# EAGLE schematic BEP32_Test_Interface7 (EAGLE 7.7.0)
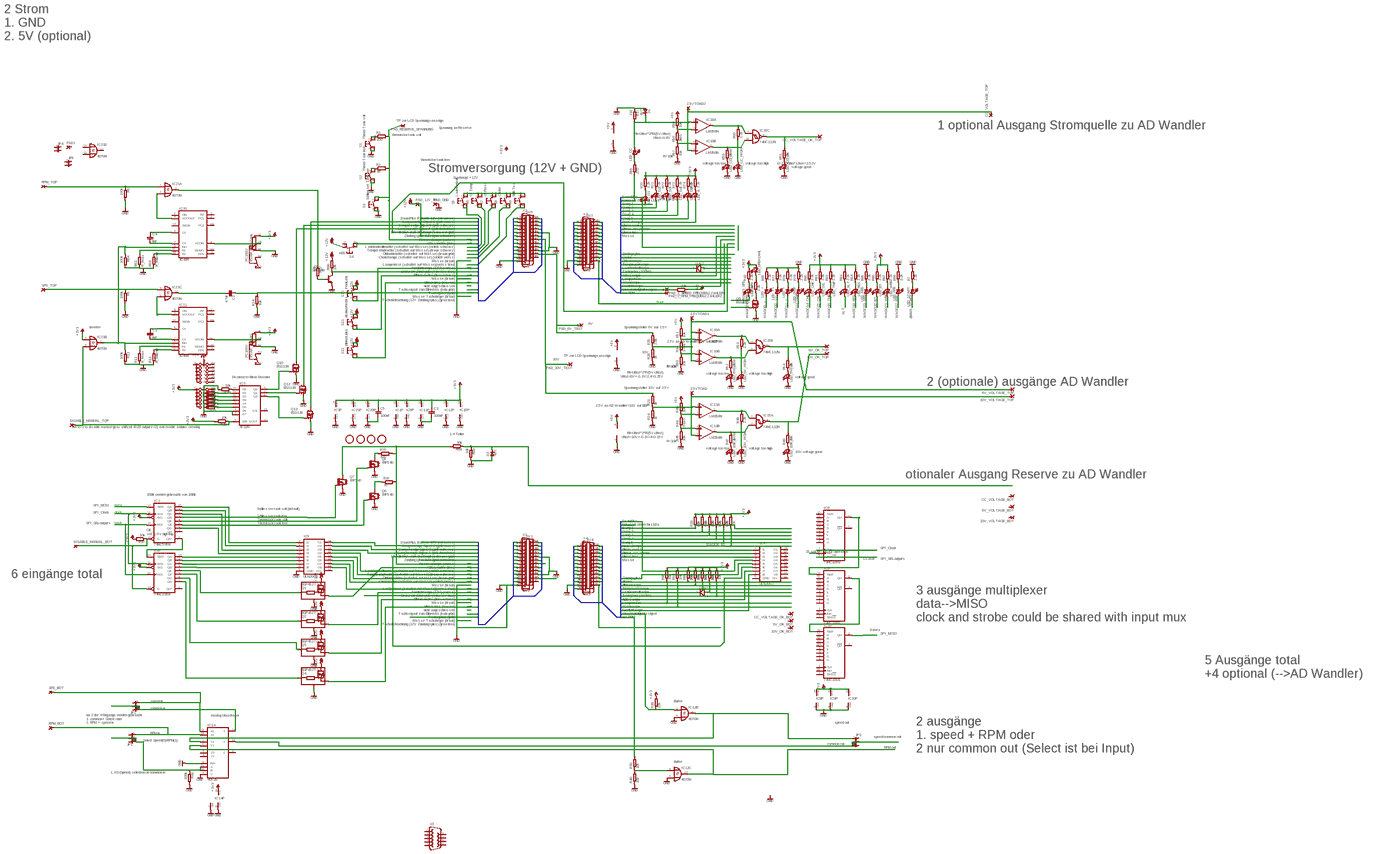
[diagram p0: schematic, sheet 1, overview]
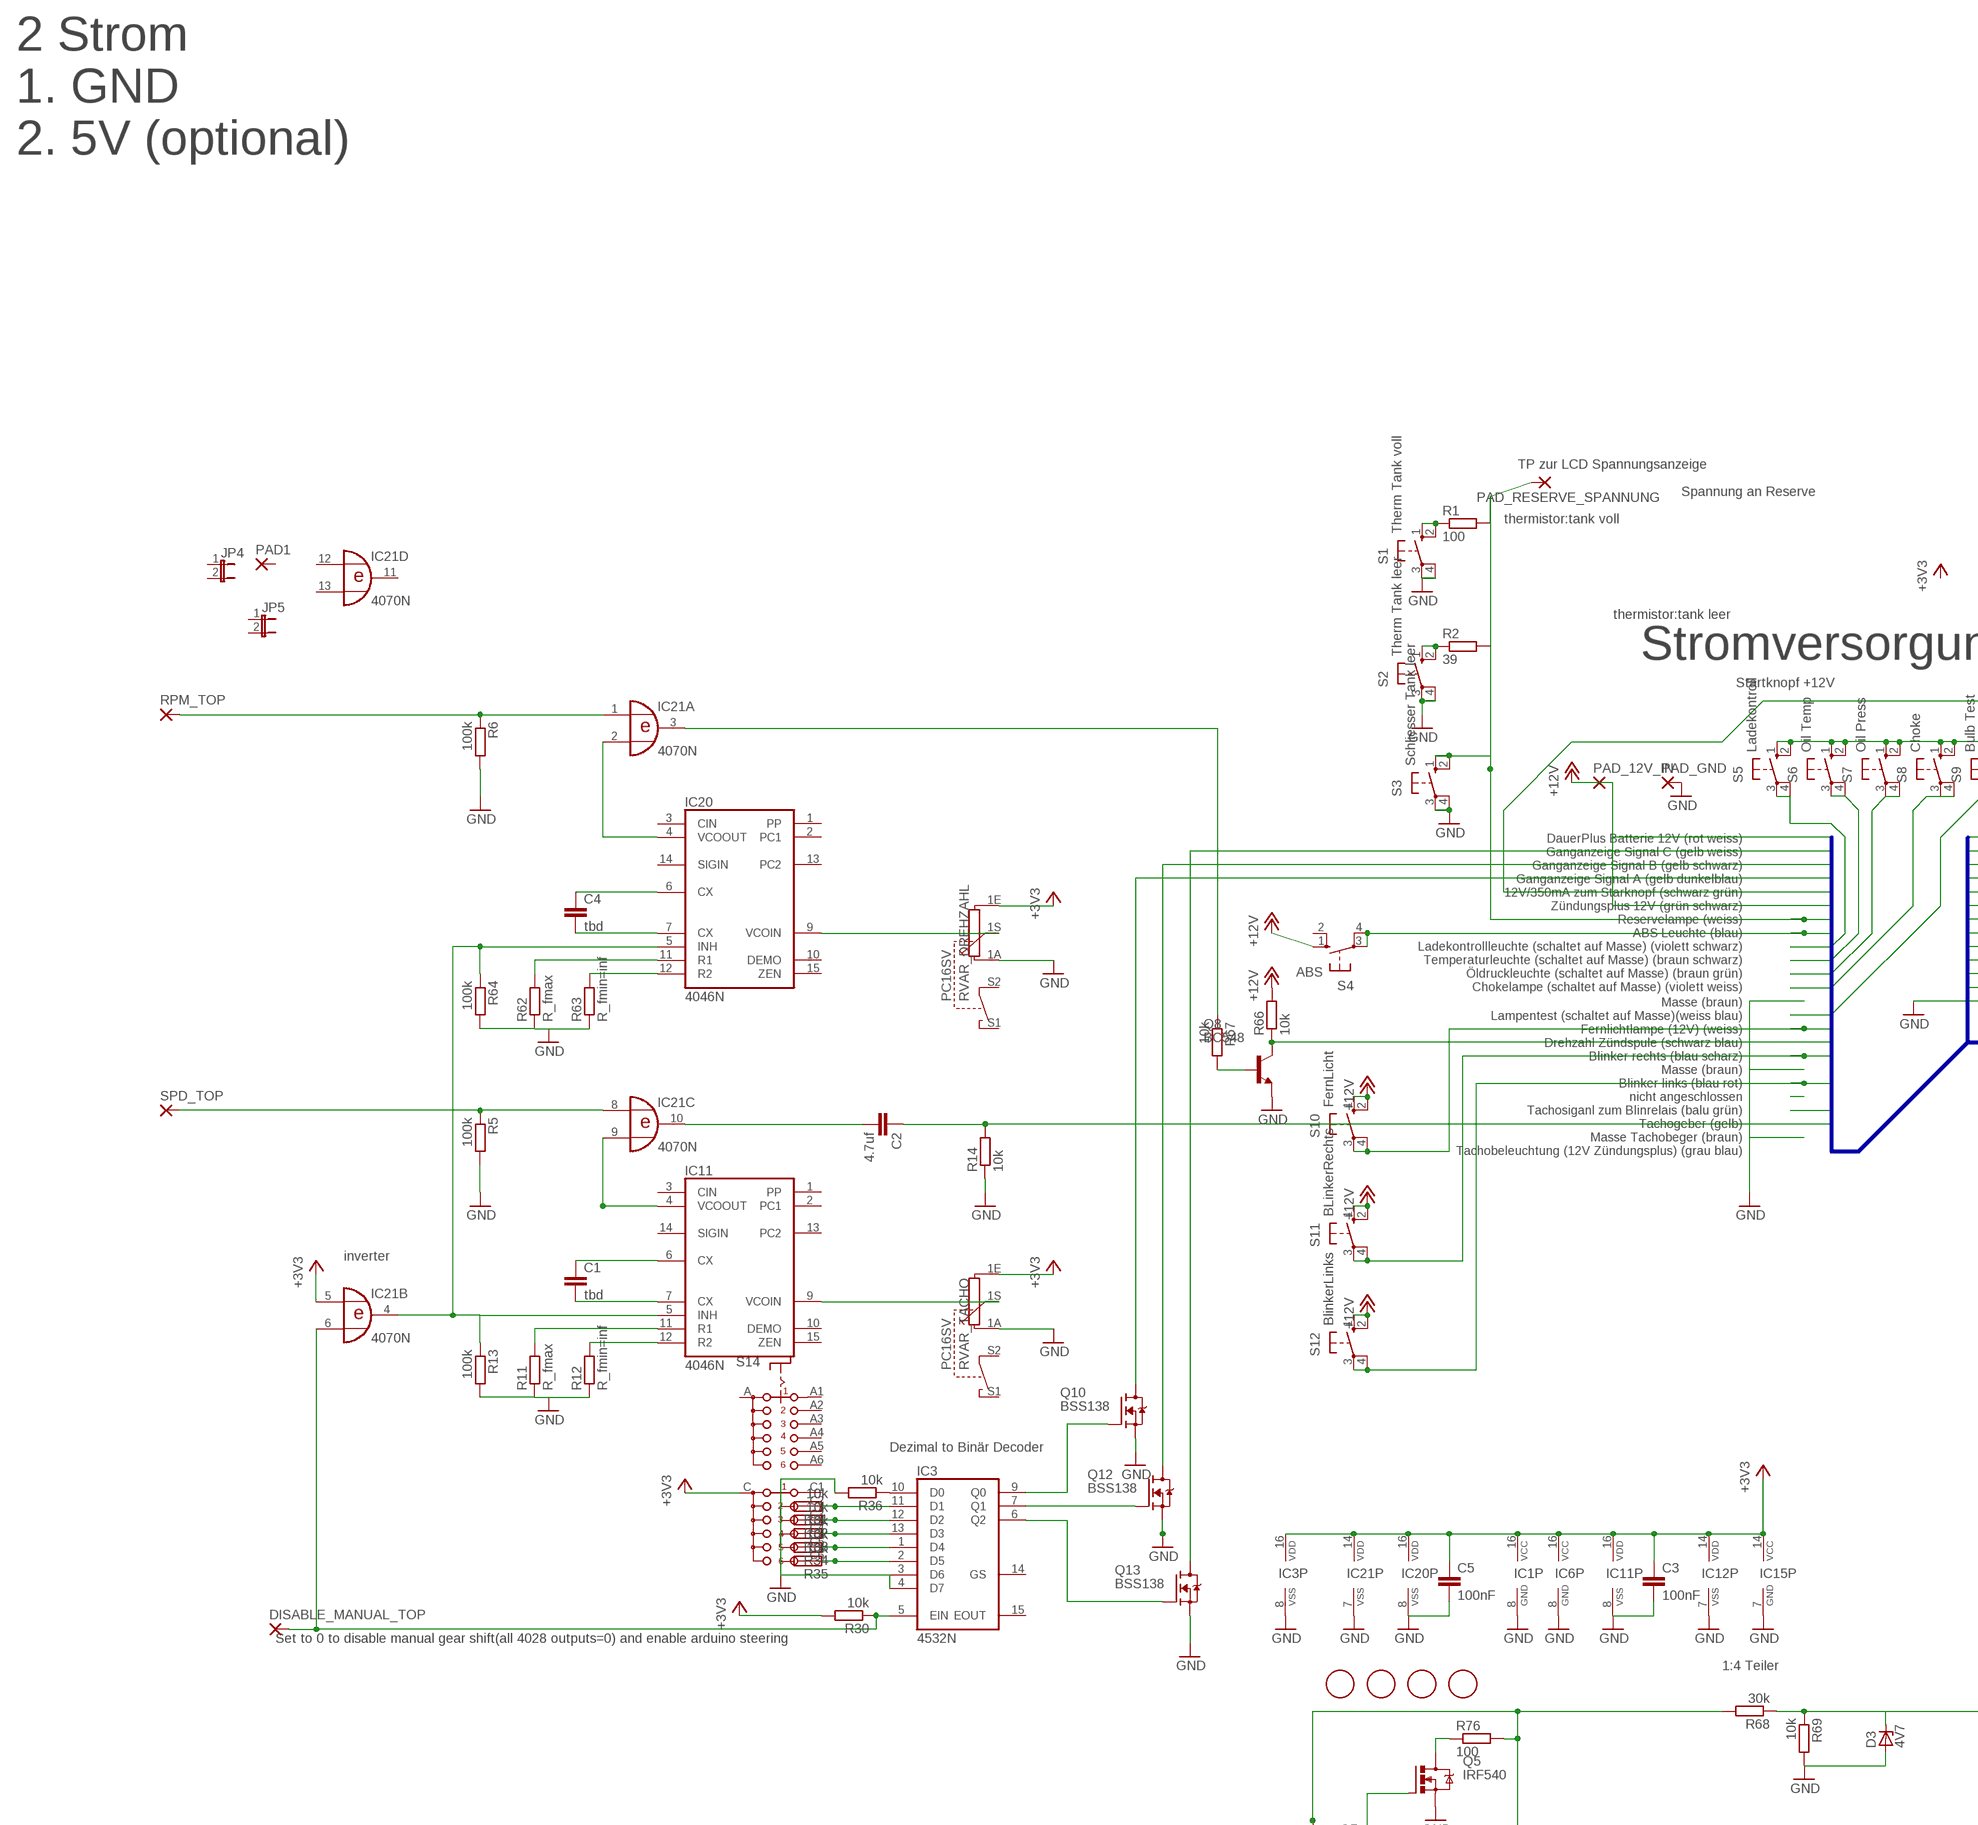
[diagram p1: schematic, sheet 1, part 1 of 6]
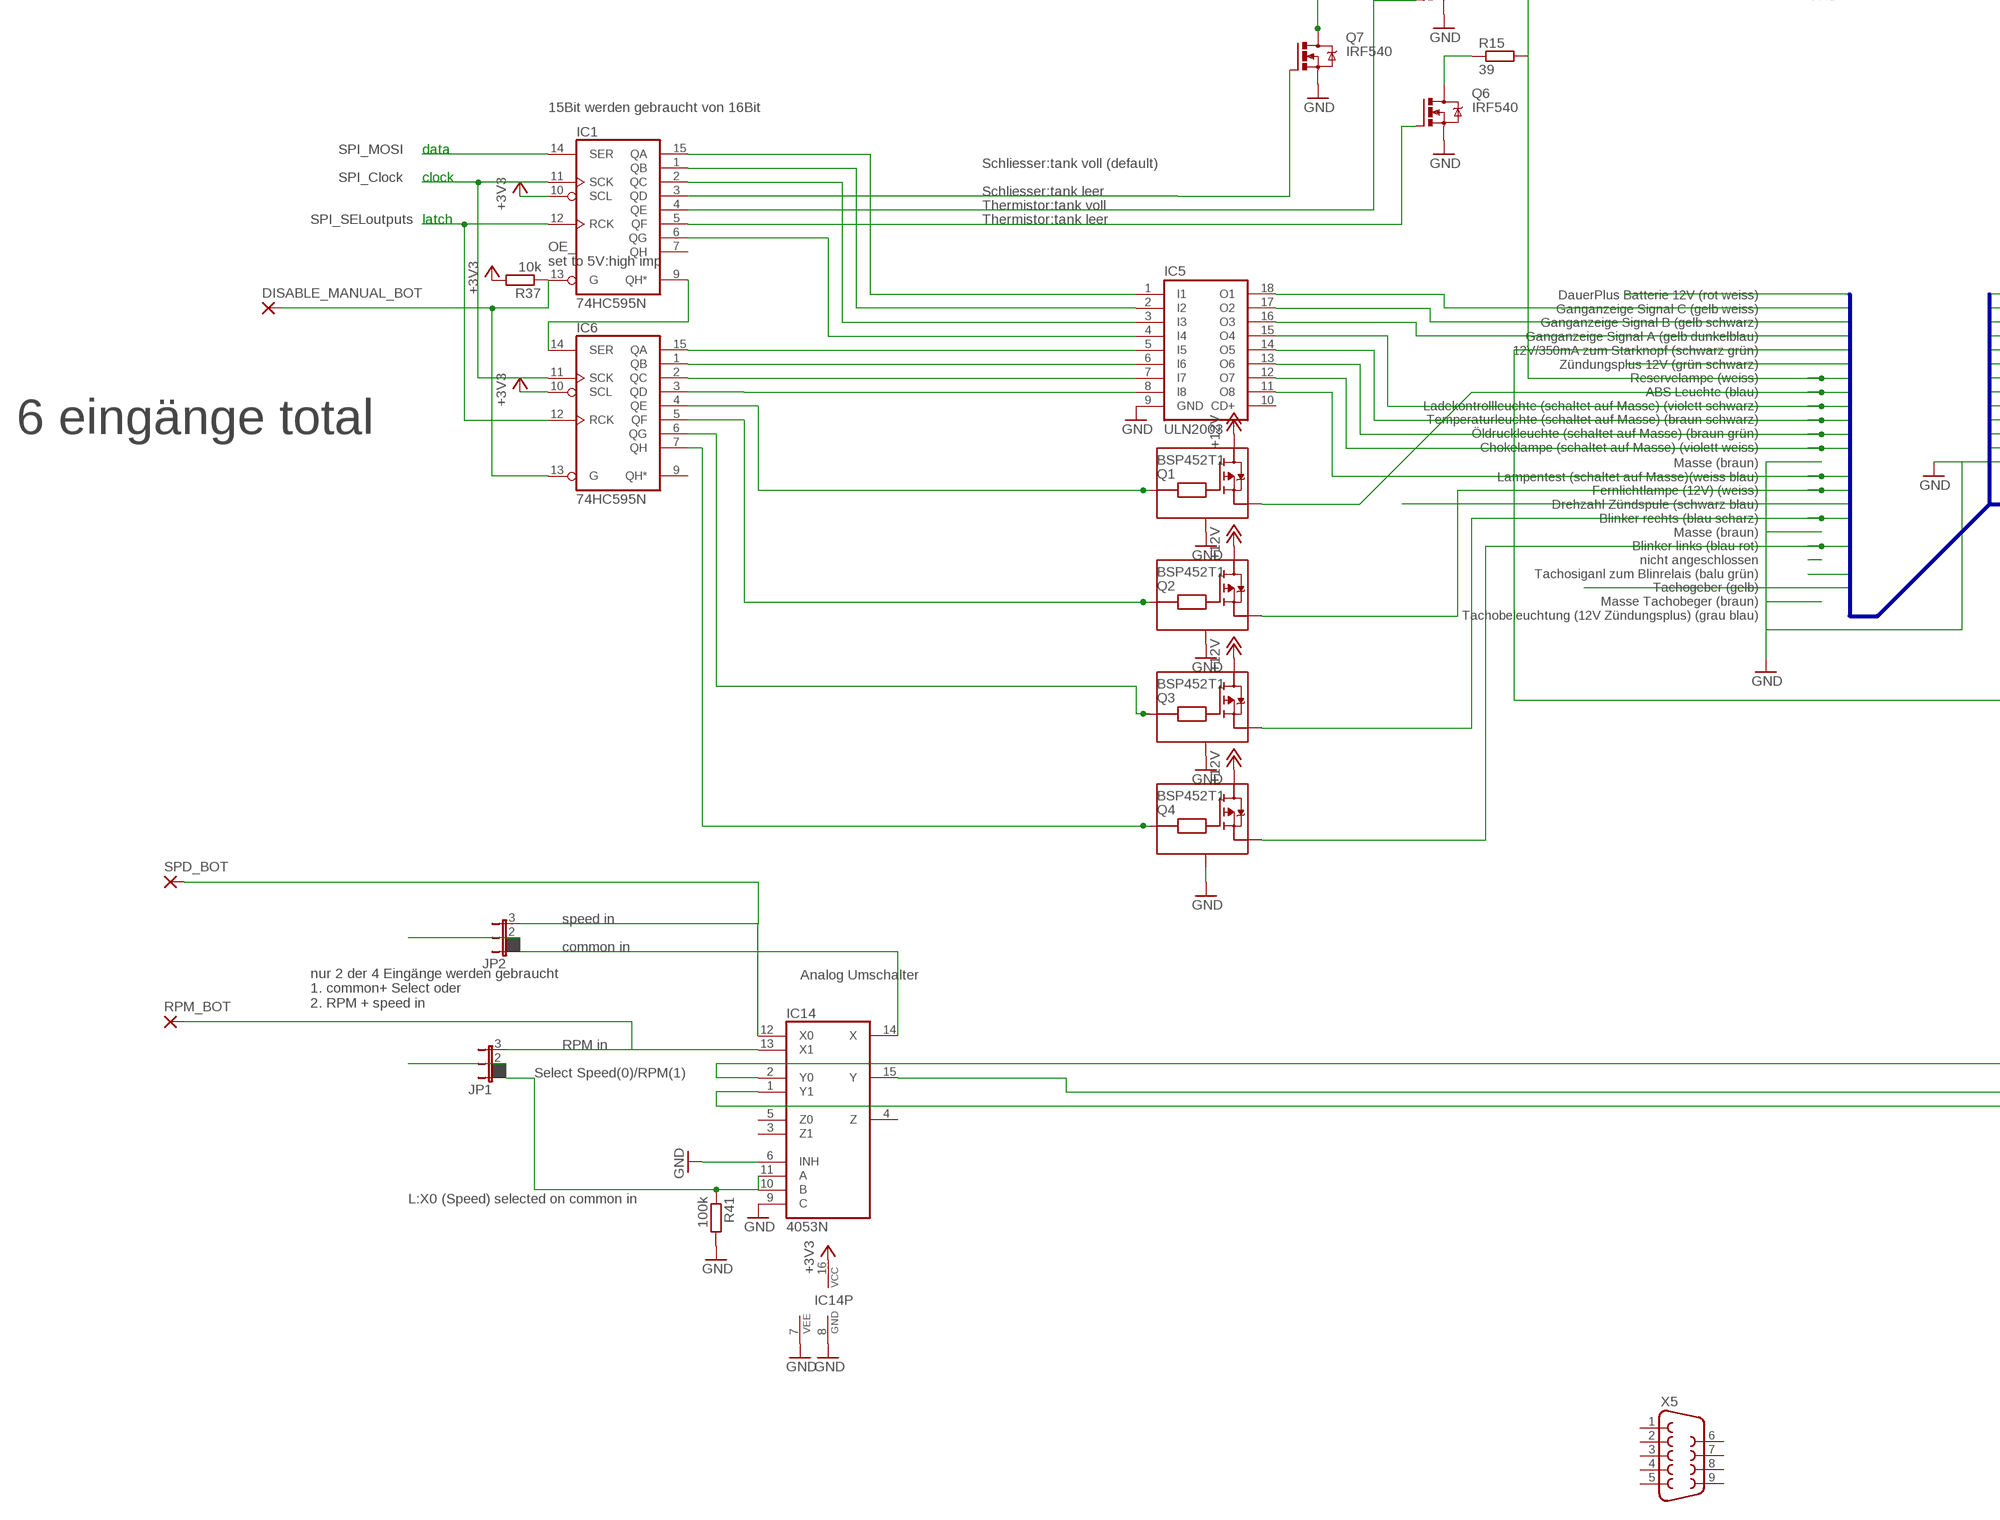
[diagram p2: schematic, sheet 1, part 2 of 6]
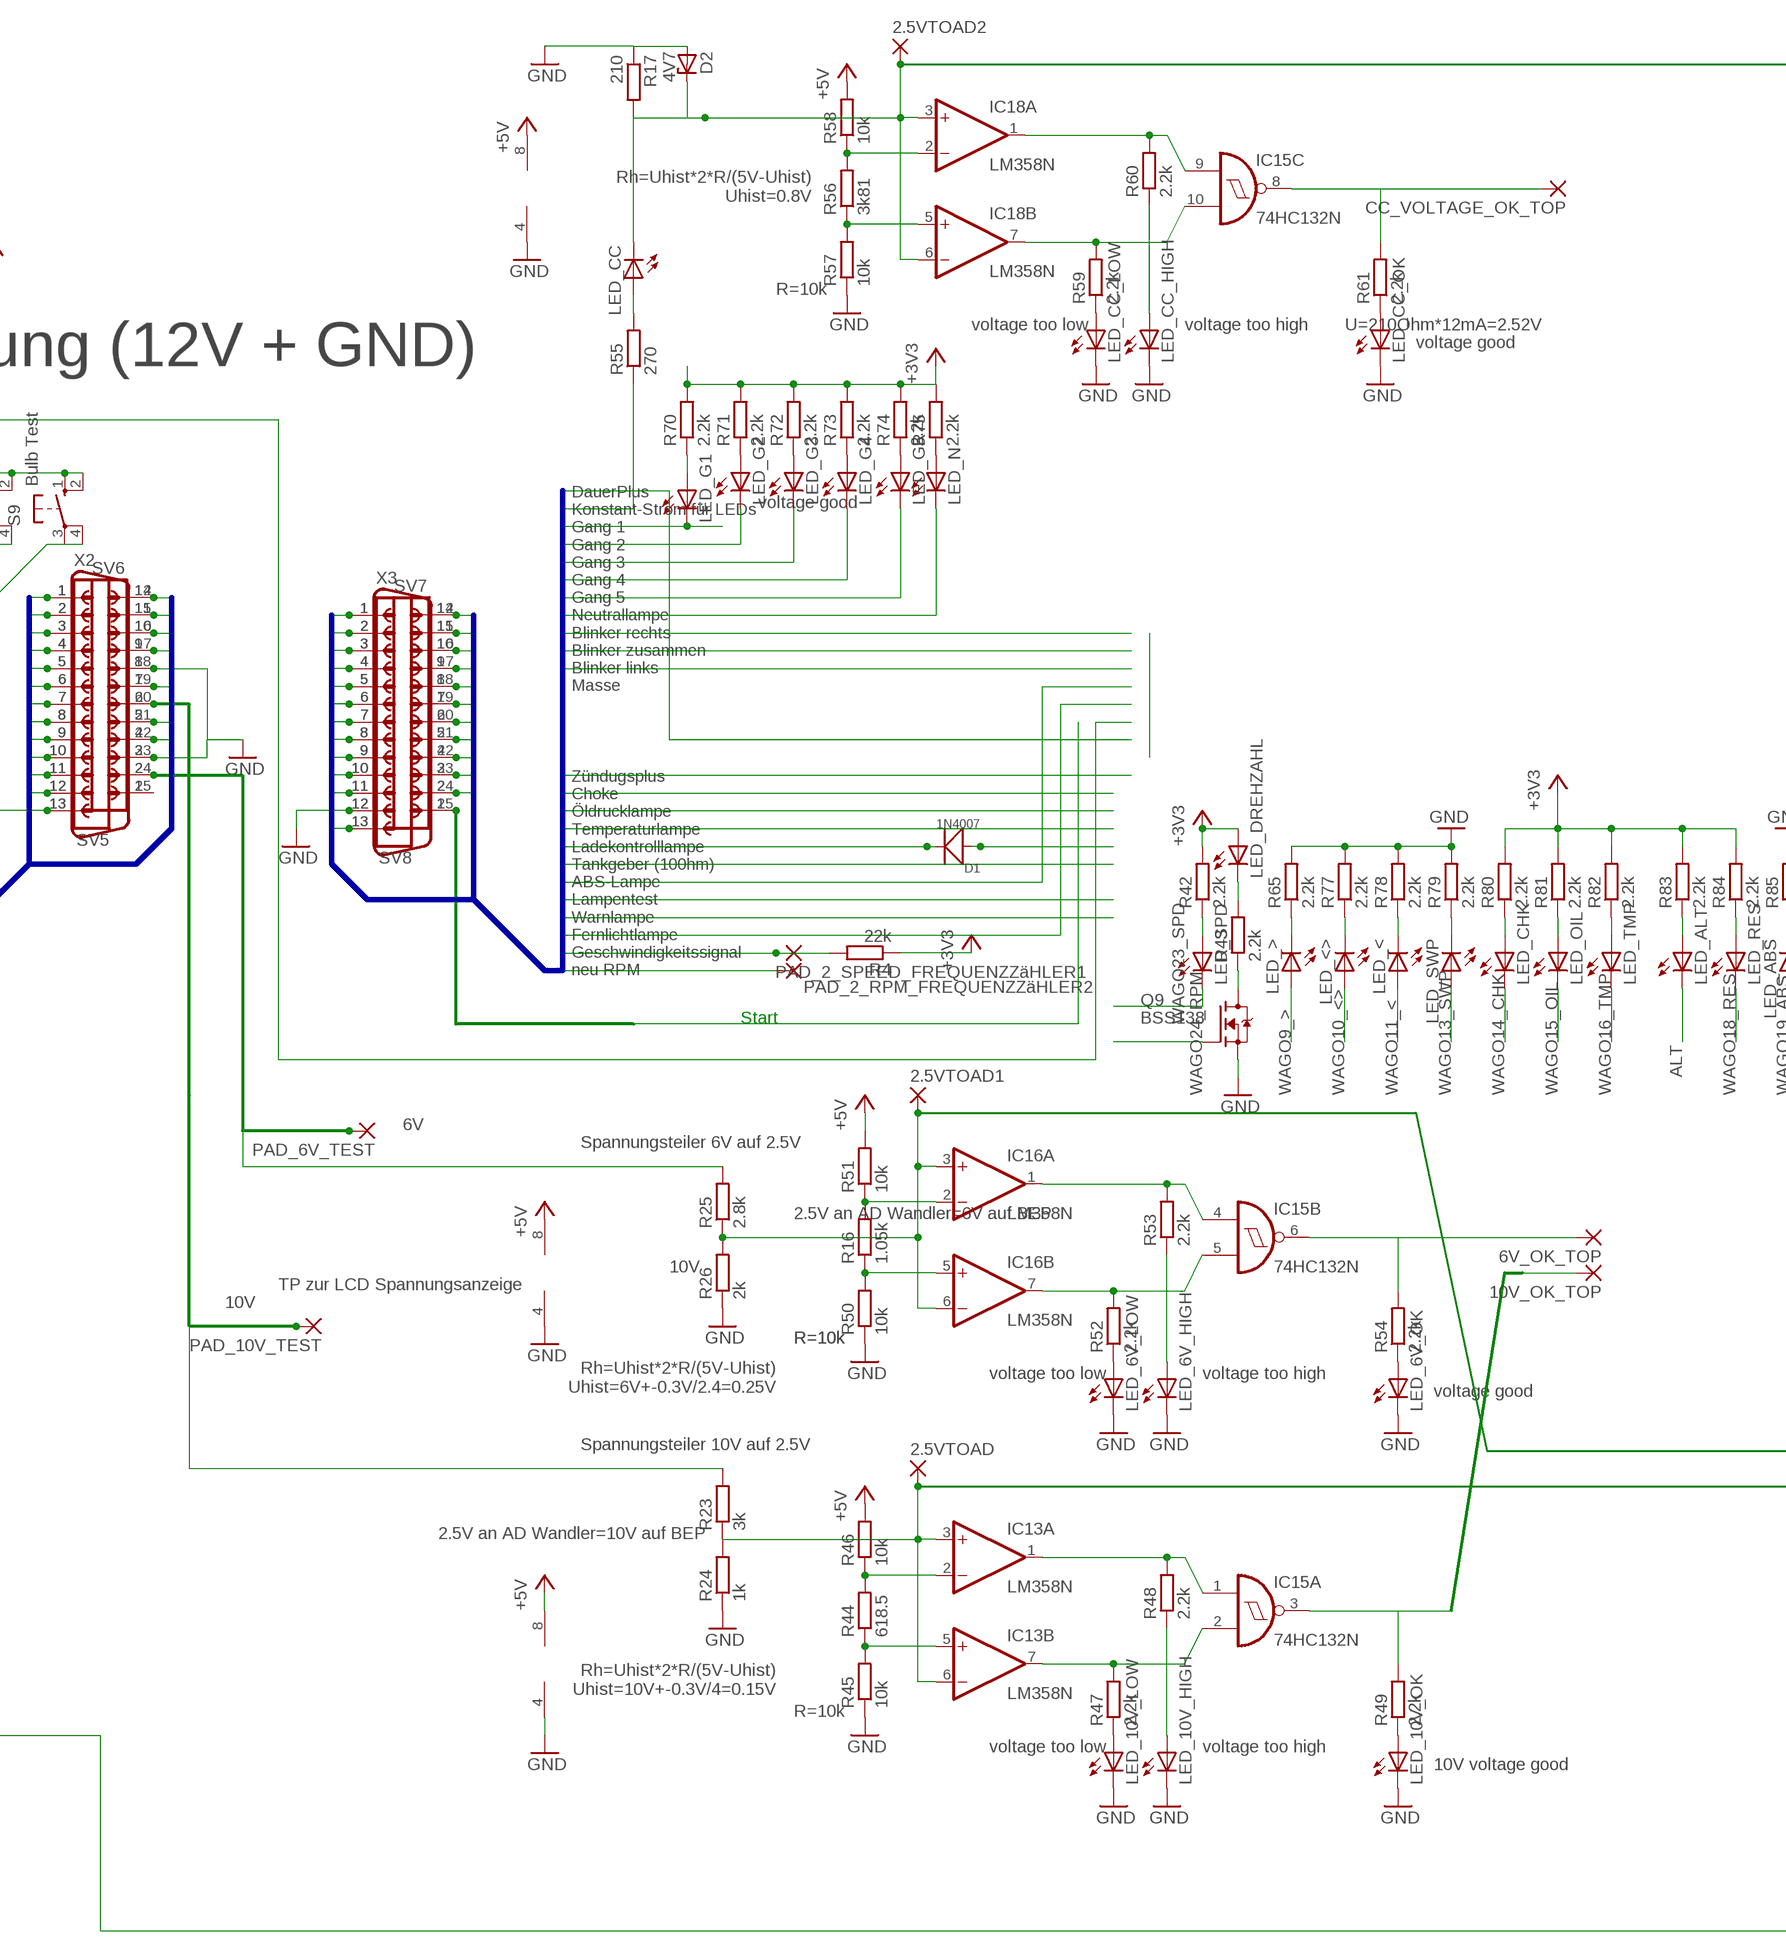
[diagram p3: schematic, sheet 1, part 3 of 6]
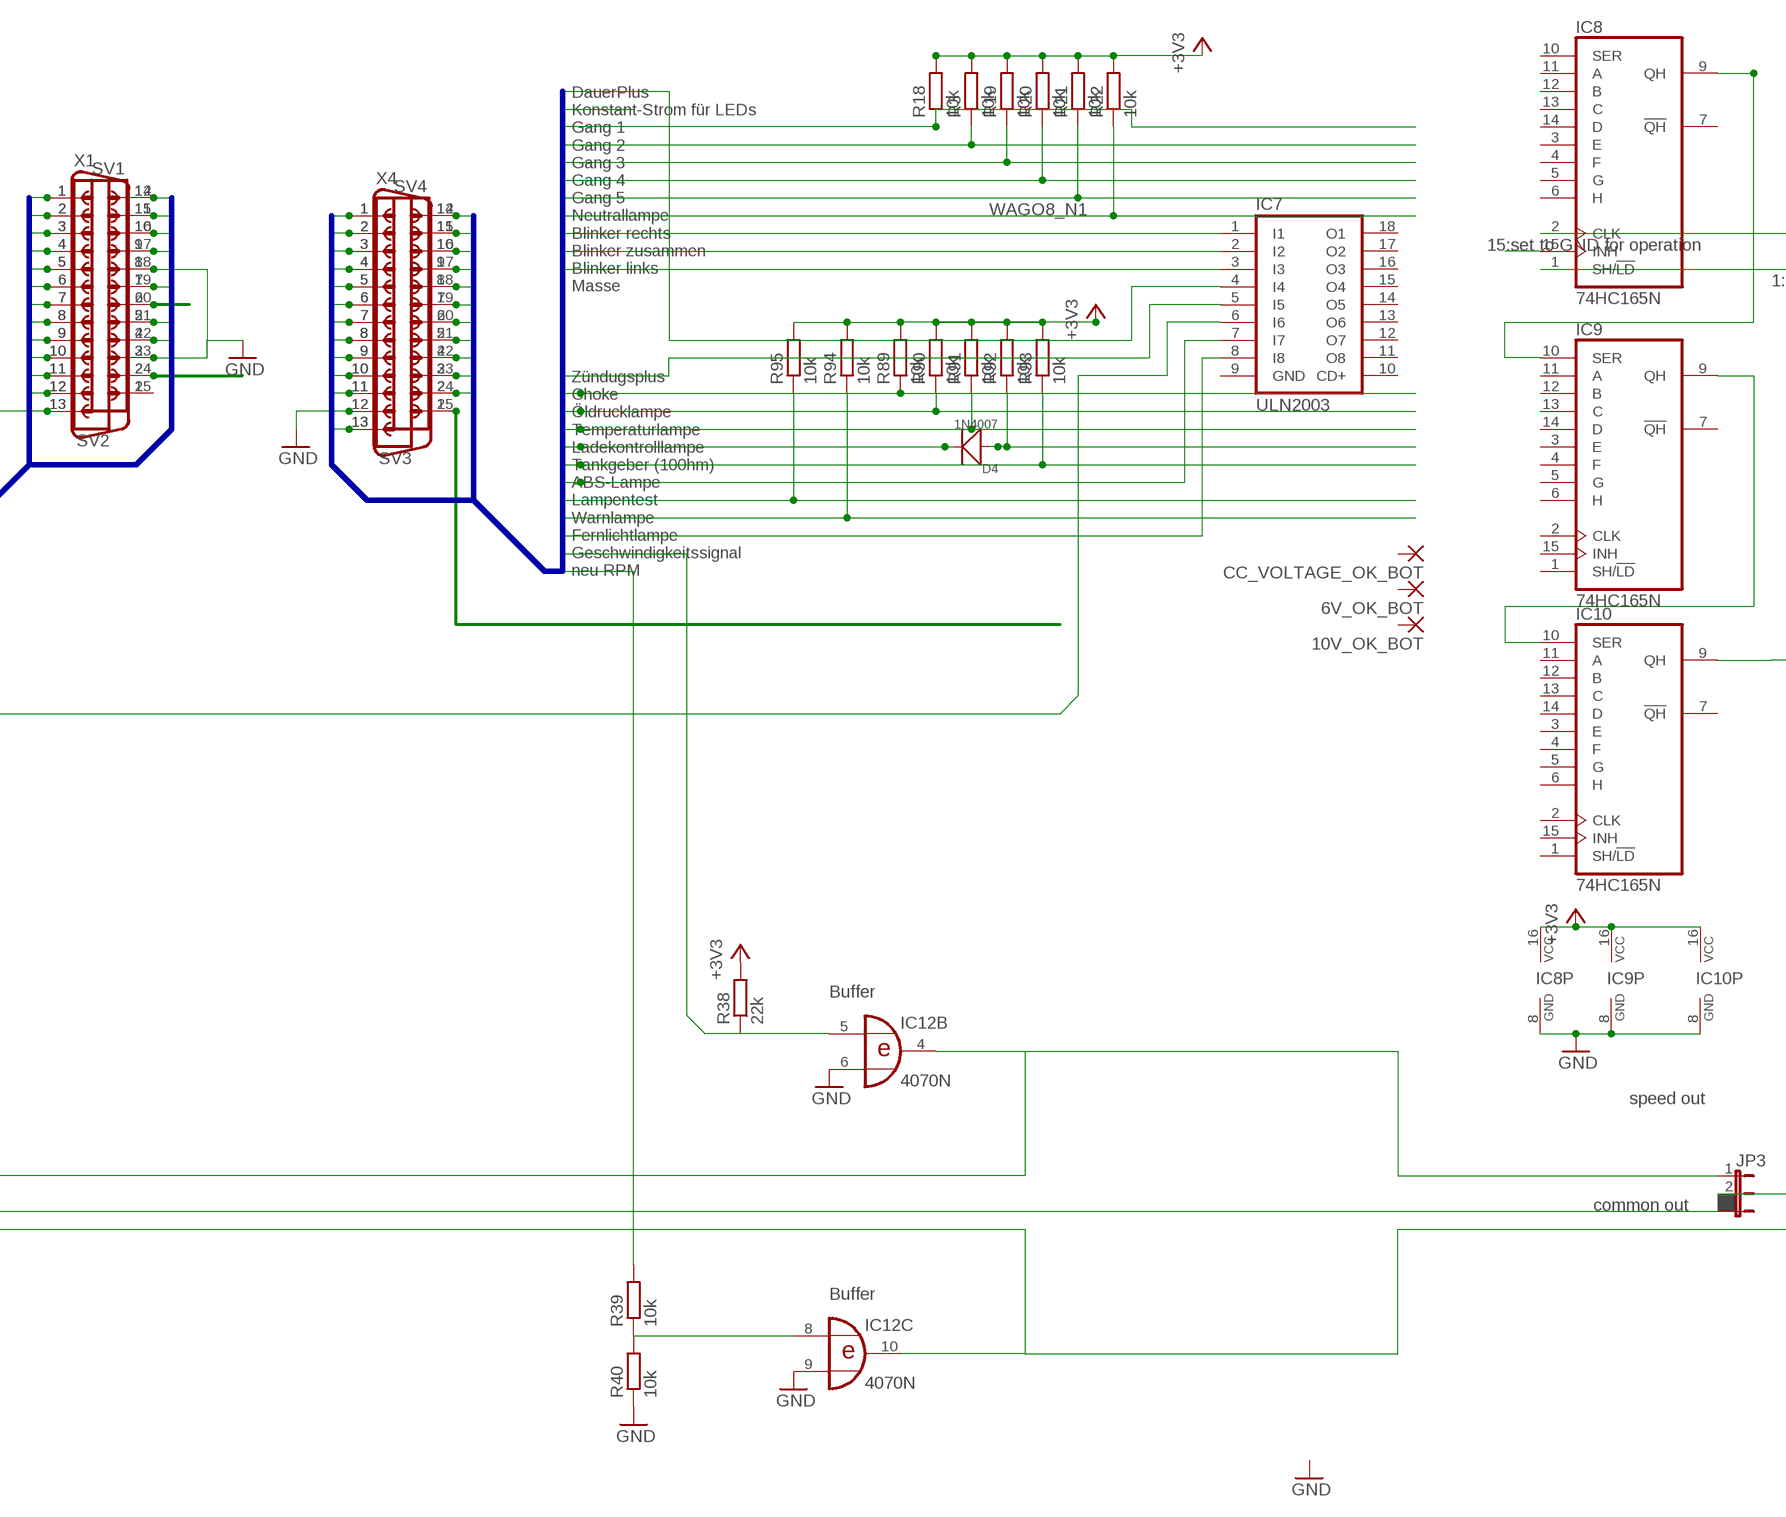
[diagram p4: schematic, sheet 1, part 4 of 6]
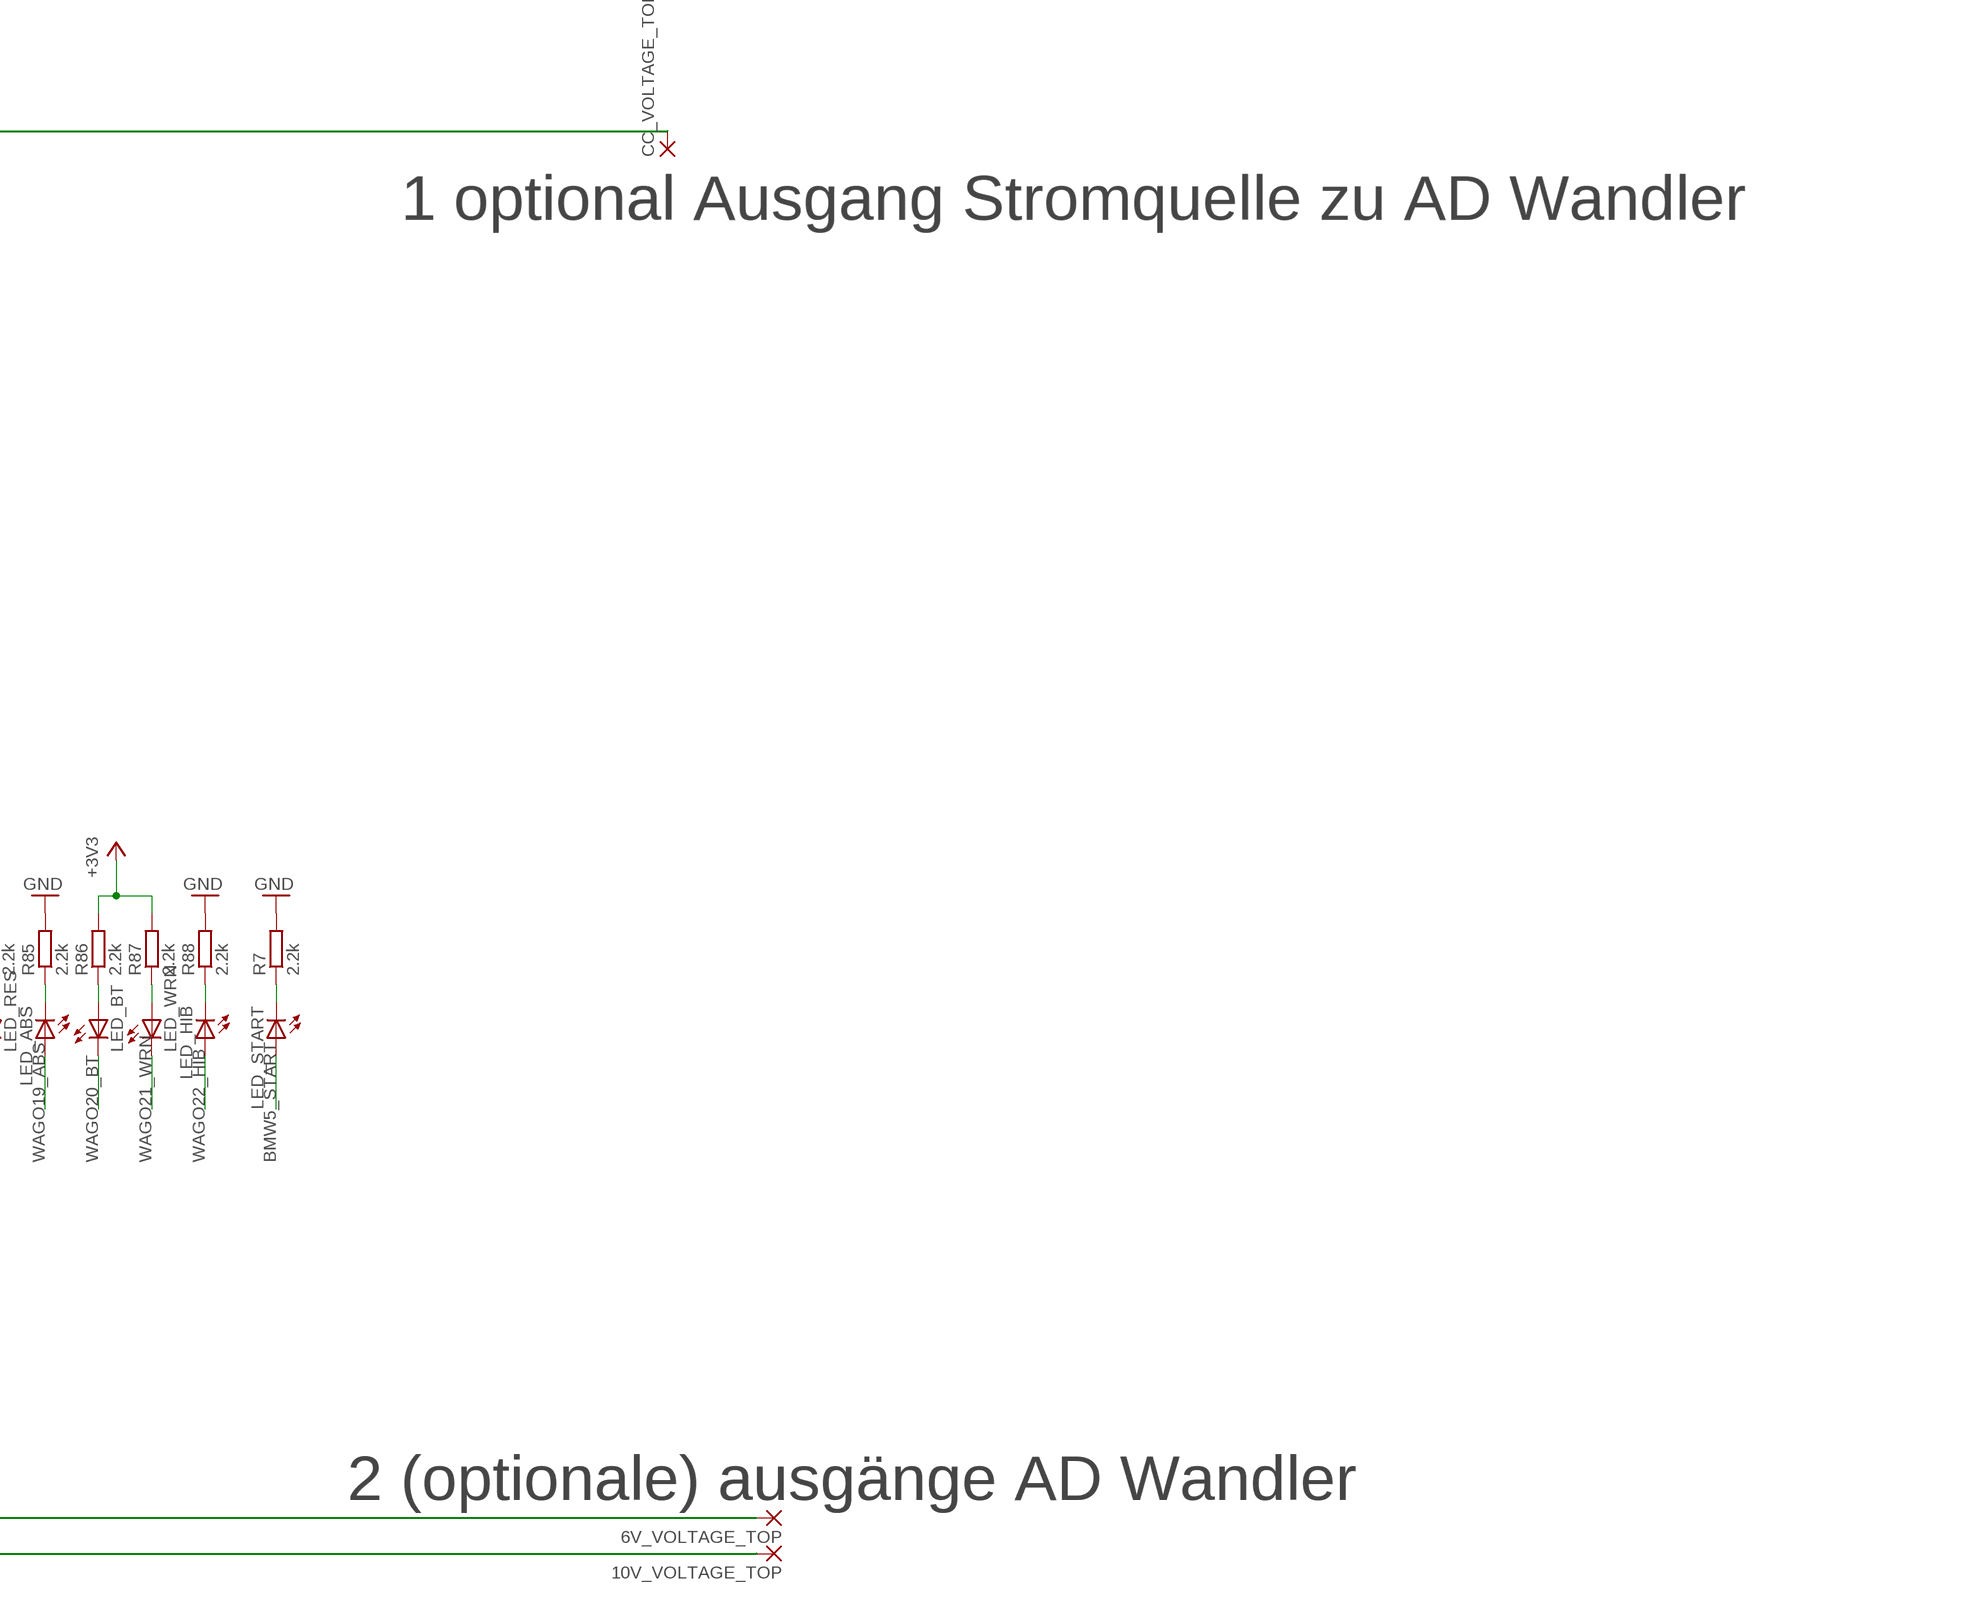
[diagram p5: schematic, sheet 1, part 5 of 6]
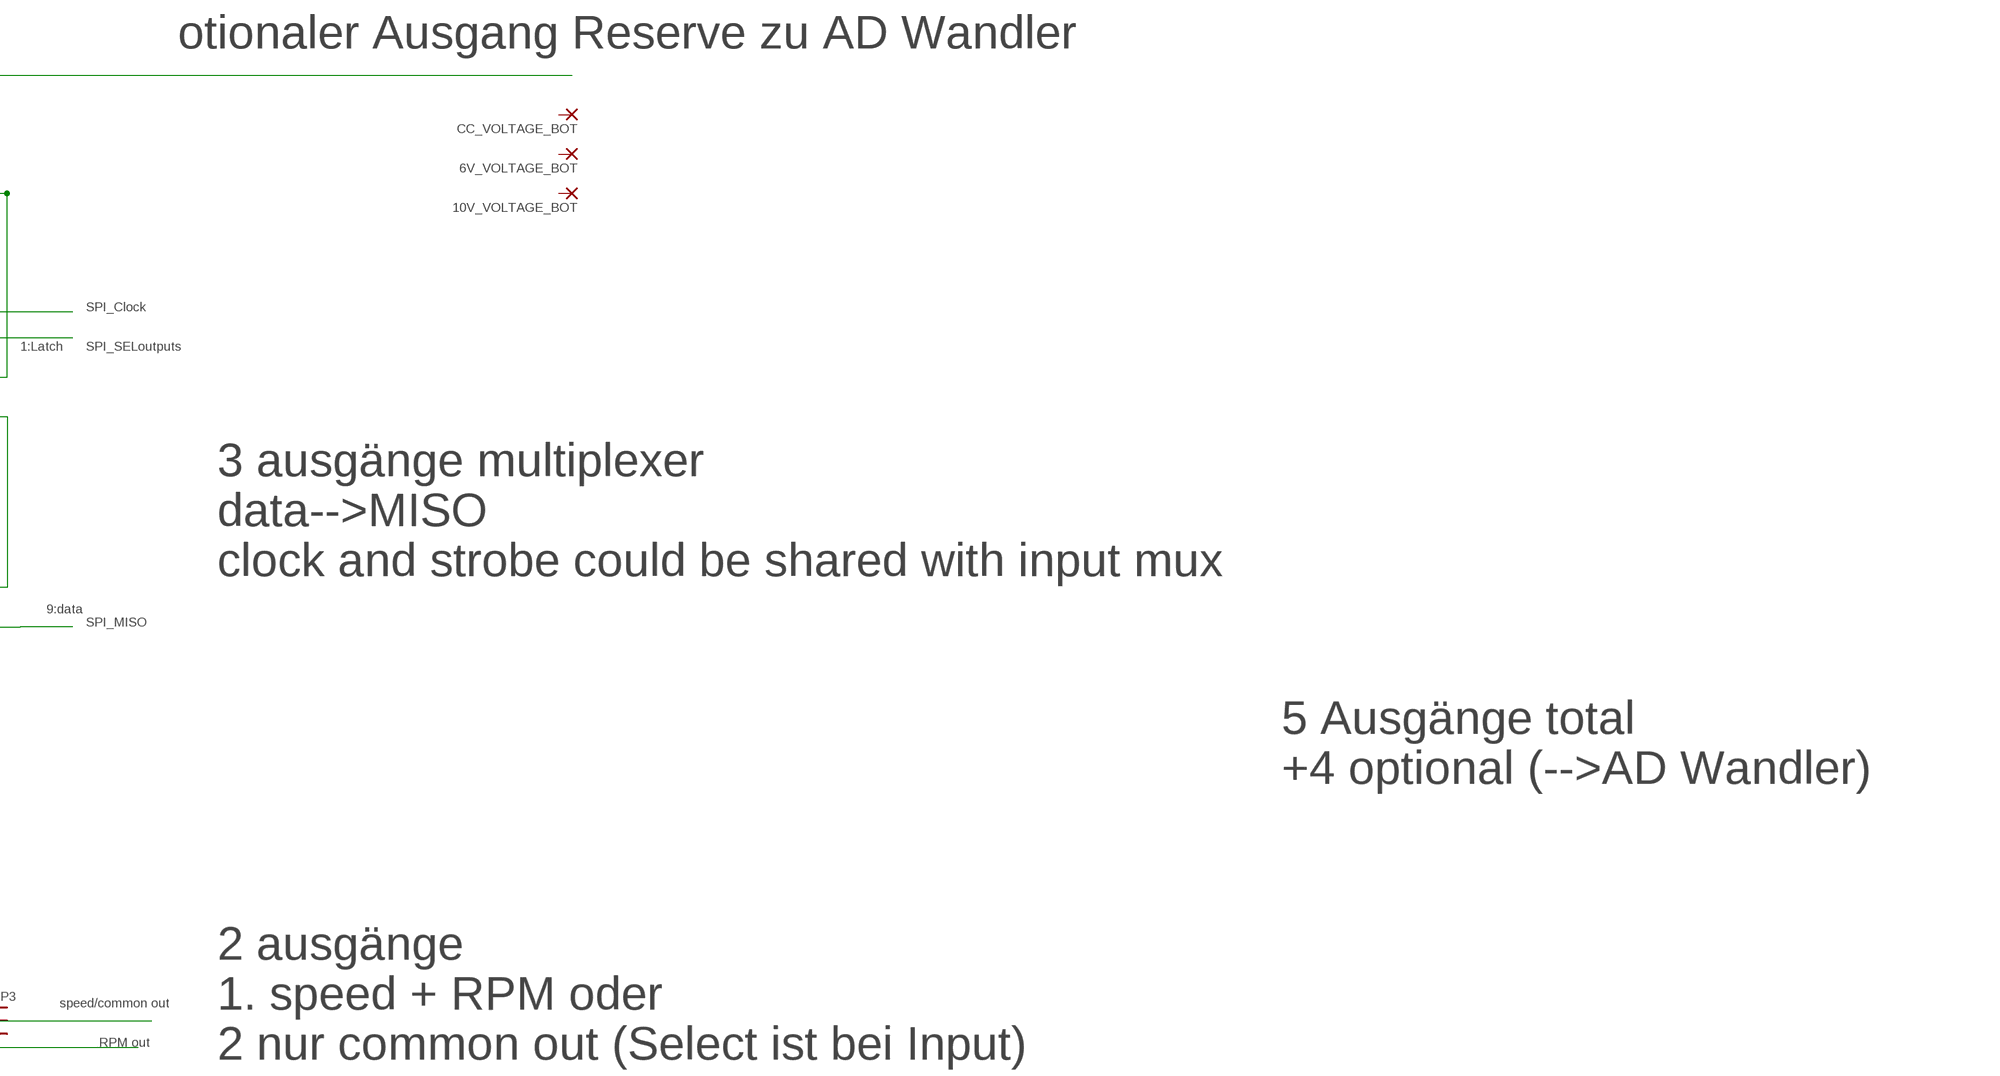
[diagram p6: schematic, sheet 1, part 6 of 6]

## Parts
2.5VTOAD  1,6/0,9  [1,6/0,9]
2.5VTOAD1  1,6/0,9  [1,6/0,9]
2.5VTOAD2  1,6/0,9  [1,6/0,9]
6V_OK_BOT  1,6/0,9  [1,6/0,9]
6V_OK_TOP  1,6/0,9  [1,6/0,9]
6V_VOLTAGE_BOT  1,6/0,9  [1,6/0,9]
6V_VOLTAGE_TOP  1,6/0,9  [1,6/0,9]
10V_OK_BOT  1,6/0,9  [1,6/0,9]
10V_OK_TOP  1,6/0,9  [1,6/0,9]
10V_VOLTAGE_BOT  1,6/0,9  [1,6/0,9]
10V_VOLTAGE_TOP  1,6/0,9  [1,6/0,9]
C1  tbd  C-EUC1206K  [C1206K]
C2  4.7uf  C-EU025_050-025X075  [C025_050-025X075]
C3  100nF  C-EUC1206K  [C1206K]
C4  tbd  C-EUC1206K  [C1206K]
C5  100nF  C-EUC1206K  [C1206K]
CC_VOLTAGE_BOT  1,6/0,9  [1,6/0,9]
CC_VOLTAGE_OK_BOT  1,6/0,9  [1,6/0,9]
CC_VOLTAGE_OK_TOP  1,6/0,9  [1,6/0,9]
CC_VOLTAGE_TOP  1,6/0,9  [1,6/0,9]
D1  1N4007  DIODE-GEN-PURPOSE-1KV-1A(DO-214AC)  [DO-214AC]
D2  4V7  ZENER-DIODEF126-10  [F126Z10]
D3  4V7  ZENER-DIODEF126-10  [F126Z10]
D4  1N4007  DIODE-GEN-PURPOSE-1KV-1A(DO-214AC)  [DO-214AC]
DISABLE_MANUAL_BOT  1,6/0,9  [1,6/0,9]
DISABLE_MANUAL_TOP  1,6/0,9  [1,6/0,9]
IC1  74HC595N  [DIL16]
IC3  4532N  [DIL16]
IC5  ULN2003  ULN2803A  [DIL18]
IC6  74HC595N  [DIL16]
IC7  ULN2003  ULN2803A  [DIL18]
IC8  74HC165N  [DIL16]
IC9  74HC165N  [DIL16]
IC10  74HC165N  [DIL16]
IC11  4046N  [DIL16]
IC12  4070N  [DIL14]
IC13  LM358N  [DIL08]
IC14  4053N  [DIL16]
IC15  74HC132N  [DIL14]
IC16  LM358N  [DIL08]
IC18  LM358N  [DIL08]
IC20  4046N  [DIL16]
IC21  4070N  [DIL14]
JP1  JP2E  [JP2]
JP2  JP2E  [JP2]
JP3  JP2E  [JP2]
JP4  JP1E  [JP1]
JP5  JP1E  [JP1]
LED_6V_HIGH  LED5MM  [LED5MM]
LED_6V_LOW  LED5MM  [LED5MM]
LED_6V_OK  LED5MM  [LED5MM]
LED_10V_HIGH  LED5MM  [LED5MM]
LED_10V_LOW  LED5MM  [LED5MM]
LED_10V_OK  LED5MM  [LED5MM]
LED_<  LED5MM  [LED5MM]
LED_<>  LED5MM  [LED5MM]
LED_>  LED5MM  [LED5MM]
LED_ABS  LED5MM  [LED5MM]
LED_ALT  LED5MM  [LED5MM]
LED_BT  LED5MM  [LED5MM]
LED_CC  LED5MM  [LED5MM]
LED_CC_HIGH  LED5MM  [LED5MM]
LED_CC_LOW  LED5MM  [LED5MM]
LED_CC_OK  LED5MM  [LED5MM]
LED_CHK  LED5MM  [LED5MM]
LED_DREHZAHL  LED5MM  [LED5MM]
LED_G1  LED5MM  [LED5MM]
LED_G2  LED5MM  [LED5MM]
LED_G3  LED5MM  [LED5MM]
LED_G4  LED5MM  [LED5MM]
LED_G5  LED5MM  [LED5MM]
LED_HIB  LED5MM  [LED5MM]
LED_N  LED5MM  [LED5MM]
LED_OIL  LED5MM  [LED5MM]
LED_RES  LED5MM  [LED5MM]
LED_SPD  LED5MM  [LED5MM]
LED_START  LED5MM  [LED5MM]
LED_SWP  LED5MM  [LED5MM]
LED_TMP  LED5MM  [LED5MM]
LED_WRN  LED5MM  [LED5MM]
PAD1  1,6/0,9  [1,6/0,9]
PAD_2_RPM_FREQUENZZäHLER2  1,6/0,9  [1,6/0,9]
PAD_2_SPEED_FREQUENZZäHLER1  1,6/0,9  [1,6/0,9]
PAD_6V_TEST  1,6/0,9  [1,6/0,9]
PAD_10V_TEST  1,6/0,9  [1,6/0,9]
PAD_12V_IN  1,6/0,9  [1,6/0,9]
PAD_GND  1,6/0,9  [1,6/0,9]
PAD_RESERVE_SPANNUNG  1,6/0,9  [1,6/0,9]
Q1  BSP452T1  [SOT223]
Q2  BSP452T1  [SOT223]
Q3  BSP452T1  [SOT223]
Q4  BSP452T1  [SOT223]
Q5  IRF540  [TO220BV]
Q6  IRF540  [TO220BV]
Q7  IRF540  [TO220BV]
Q8  BC548  [TO92-EBC]
Q9  BSS138  [SOT23]
Q10  BSS138  [SOT23]
Q12  BSS138  [SOT23]
Q13  BSS138  [SOT23]
R1  100  R-EU_0207/10  [0207/10]
R2  39  R-EU_0207/10  [0207/10]
R3  10k  R-EU_0207/10  [0207/10]
R4  22k  R-EU_0207/10  [0207/10]
R5  100k  R-EU_0207/10  [0207/10]
R6  100k  R-EU_0207/10  [0207/10]
R7  2.2k  R-EU_0207/10  [0207/10]
R11  R_fmax  R-EU_0207/10  [0207/10]
R12  R_fmin=inf  R-EU_0207/10  [0207/10]
R13  100k  R-EU_0207/10  [0207/10]
R14  10k  R-EU_0207/10  [0207/10]
R15  39  R-EU_0207/10  [0207/10]
R16  1.05k  R-EU_0207/10  [0207/10]
R17  210  R-EU_0207/10  [0207/10]
R18  10k  R-EU_0207/10  [0207/10]
R19  10k  R-EU_0207/10  [0207/10]
R20  10k  R-EU_0207/10  [0207/10]
R21  10k  R-EU_0207/10  [0207/10]
R22  10k  R-EU_0207/10  [0207/10]
R23  3k  R-EU_0207/10  [0207/10]
R24  1k  R-EU_0207/10  [0207/10]
R25  2.8k  R-EU_0207/10  [0207/10]
R26  2k  R-EU_0207/10  [0207/10]
R30  10k  R-EU_0207/10  [0207/10]
R31  10k  R-EU_0207/10  [0207/10]
R32  10k  R-EU_0207/10  [0207/10]
R33  10k  R-EU_0207/10  [0207/10]
R34  10k  R-EU_0207/10  [0207/10]
R35  10k  R-EU_0207/10  [0207/10]
R36  10k  R-EU_0207/10  [0207/10]
R37  10k  R-EU_0207/10  [0207/10]
R38  22k  R-EU_0207/10  [0207/10]
R39  10k  R-EU_0207/10  [0207/10]
R40  10k  R-EU_0207/10  [0207/10]
R41  100k  R-EU_0207/10  [0207/10]
R42  2.2k  R-EU_0207/10  [0207/10]
R43  2.2k  R-EU_0207/10  [0207/10]
R44  618.5  R-EU_0207/10  [0207/10]
R45  10k  R-EU_0207/10  [0207/10]
R46  10k  R-EU_0207/10  [0207/10]
R47  2.2k  R-EU_0207/10  [0207/10]
R48  2.2k  R-EU_0207/10  [0207/10]
R49  2.2k  R-EU_0207/10  [0207/10]
R50  10k  R-EU_0207/10  [0207/10]
R51  10k  R-EU_0207/10  [0207/10]
R52  2.2k  R-EU_0207/10  [0207/10]
R53  2.2k  R-EU_0207/10  [0207/10]
R54  2.2k  R-EU_0207/10  [0207/10]
R55  270  R-EU_0207/10  [0207/10]
R56  3k81  R-EU_0207/10  [0207/10]
R57  10k  R-EU_0207/10  [0207/10]
R58  10k  R-EU_0207/10  [0207/10]
R59  2.2k  R-EU_0207/10  [0207/10]
R60  2.2k  R-EU_0207/10  [0207/10]
R61  2.2k  R-EU_0207/10  [0207/10]
R62  R_fmax  R-EU_0207/10  [0207/10]
R63  R_fmin=inf  R-EU_0207/10  [0207/10]
R64  100k  R-EU_0207/10  [0207/10]
R65  2.2k  R-EU_0207/10  [0207/10]
R66  10k  R-EU_0207/10  [0207/10]
R67  10k  R-EU_0207/10  [0207/10]
R68  30k  R-EU_0207/10  [0207/10]
R69  10k  R-EU_0207/10  [0207/10]
R70  2.2k  R-EU_0207/10  [0207/10]
R71  2.2k  R-EU_0207/10  [0207/10]
R72  2.2k  R-EU_0207/10  [0207/10]
R73  2.2k  R-EU_0207/10  [0207/10]
R74  2.2k  R-EU_0207/10  [0207/10]
R75  2.2k  R-EU_0207/10  [0207/10]
R76  100  R-EU_0207/10  [0207/10]
R77  2.2k  R-EU_0207/10  [0207/10]
R78  2.2k  R-EU_0207/10  [0207/10]
R79  2.2k  R-EU_0207/10  [0207/10]
R80  2.2k  R-EU_0207/10  [0207/10]
R81  2.2k  R-EU_0207/10  [0207/10]
R82  2.2k  R-EU_0207/10  [0207/10]
R83  2.2k  R-EU_0207/10  [0207/10]
R84  2.2k  R-EU_0207/10  [0207/10]
R85  2.2k  R-EU_0207/10  [0207/10]
R86  2.2k  R-EU_0207/10  [0207/10]
R87  2.2k  R-EU_0207/10  [0207/10]
R88  2.2k  R-EU_0207/10  [0207/10]
R89  10k  R-EU_0207/10  [0207/10]
R90  10k  R-EU_0207/10  [0207/10]
R91  10k  R-EU_0207/10  [0207/10]
R92  10k  R-EU_0207/10  [0207/10]
R93  10k  R-EU_0207/10  [0207/10]
R94  10k  R-EU_0207/10  [0207/10]
R95  10k  R-EU_0207/10  [0207/10]
RPM_BOT  1,6/0,9  [1,6/0,9]
RPM_TOP  1,6/0,9  [1,6/0,9]
RVAR_DREHZAHL  PC16SV  [PC16SV]
RVAR_TACHO  PC16SV  [PC16SV]
S1  Therm Tank voll  40-XX  [B3F-40XX]
S2  Therm Tank leer  40-XX  [B3F-40XX]
S3  Schliesser Tank leer  40-XX  [B3F-40XX]
S4  ABS  40-XX  [B3F-40XX]
S5  Ladekontroll  40-XX  [B3F-40XX]
S6  Oil Temp  40-XX  [B3F-40XX]
S7  Oil Press  40-XX  [B3F-40XX]
S8  Choke  40-XX  [B3F-40XX]
S9  Bulb Test  40-XX  [B3F-40XX]
S10  FernLicht  40-XX  [B3F-40XX]
S11  BLinkerRechts  40-XX  [B3F-40XX]
S12  BlinkerLinks  40-XX  [B3F-40XX]
S14  CK102X06  [CK102X06]
SPD_BOT  1,6/0,9  [1,6/0,9]
SPD_TOP  1,6/0,9  [1,6/0,9]
SV1  MA12-1  [MA12-1]
SV2  MA13-1  [MA13-1]
SV3  MA13-1  [MA13-1]
SV4  MA12-1  [MA12-1]
SV5  MA13-1  [MA13-1]
SV6  MA12-1  [MA12-1]
SV7  MA12-1  [MA12-1]
SV8  MA13-1  [MA13-1]
U$1  FIDUCIAL  [FIDUCIAL_1MM]
U$2  FIDUCIAL  [FIDUCIAL_1MM]
U$3  FIDUCIAL  [FIDUCIAL_1MM]
U$4  FIDUCIAL  [FIDUCIAL_1MM]
X1  F25H  [F25H]
X2  F25H  [F25H]
X3  F25H  [F25H]
X4  F25H  [F25H]
X5  F09H  [F09H]

## Nets
+3V3: C3.1 C5.1 IC1.10(SCL) IC1.16(VCC) IC3.16(VDD) IC6.10(SCL) IC6.16(VCC) IC8.16(VCC) IC9.16(VCC) IC10.16(VCC) IC11.16(VDD) IC12.14(P:VDD) IC14.16(VCC) IC15.14(P:VCC) IC20.16(VDD) IC21.5(B:I0) IC21.14(P:VDD) LED_DREHZAHL.A R3.2 R4.1 R18.2 R19.2 R20.2 R21.2 R22.2 R30.2 R37.2 R38.2 R42.2 R70.2 R71.2 R72.2 R73.2 R74.2 R75.2 R80.2 R81.2 R82.2 R83.2 R84.2 R86.2 R87.2 R89.2 R90.2 R91.2 R92.2 R93.2 R94.2 R95.2 RVAR_DREHZAHL.1E RVAR_TACHO.1E S14.C
+5V: IC13.8(P:V+) IC16.8(P:V+) IC18.8(P:V+) R46.2 R51.2 R58.2
+12V: Q1.4(V+) Q2.4(V+) Q3.4(V+) Q4.4(V+) R66.2 S4.1(S) S10.1(S) S10.2(S1) S11.1(S) S11.2(S1) S12.1(S) S12.2(S1)
ALT: D1.1(+) LED_ALT.K(C)
ALT1: D4.1(+) R92.1
BMW1_12V: PAD_12V_IN.1(P) SV5.1 X2.1 ; supply symbol labelled +12V
BMW1_12V1: SV2.1 X1.1
BMW2_C: Q13.3(D) SV5.2 X2.2
BMW2_C1: IC5.18(O1) SV2.2 X1.2
BMW3_B: Q12.3(D) SV5.3 X2.3
BMW3_B1: IC5.17(O2) SV2.3 X1.3
BMW4_A: Q10.3(D) SV5.4 X2.4
BMW4_A1: IC5.16(O3) SV2.4 X1.4
BMW5_START: LED_START.A SV5.5 X2.5
BMW5_START1: IC7.6(I6) SV2.5 X1.5
BMW6_ZP: SV5.6 X2.6
BMW6_ZP1: SV2.6 X1.6
BMW7_RES: PAD_RESERVE_SPANNUNG.1(P) R1.2 R2.2 S3.1(S) S3.2(S1) SV5.7 X2.7
BMW7_RES1: Q7.D R68.2 R76.2 SV2.7 X1.7
BMW8_ABS: S4.3(P) S4.4(P1) SV5.8 X2.8
BMW8_ABS1: Q1.1(OUT) SV2.8 X1.8
BMW9_ALT: S5.3(P) S5.4(P1) SV5.9 X2.9
BMW9_ALT1: IC5.15(O4) SV2.9 X1.9
BMW10_TMP: S6.3(P) S6.4(P1) SV5.10 X2.10
BMW10_TMP1: IC5.14(O5) SV2.10 X1.10
BMW11_OIL: S7.3(P) S7.4(P1) SV5.11 X2.11
BMW11_OIL1: IC5.13(O6) SV2.11 X1.11
BMW12_CHK: S8.3(P) S8.4(P1) SV5.12 X2.12
BMW12_CHK1: IC5.12(O7) SV2.12 X1.12
BMW14_BT: S9.3(P) S9.4(P1) SV6.12 X2.14
BMW14_BT1: IC5.11(O8) SV1.12 X1.14
BMW15_HIB: S10.3(P) S10.4(P1) SV6.11 X2.15
BMW15_HIB1: Q2.1(OUT) SV1.11 X1.15
BMW16_RPM: Q8.C R66.1 SV6.10 X2.16
BMW16_RPM1: SV1.10 X1.16
BMW17_>: S11.3(P) S11.4(P1) SV6.9 X2.17
BMW17_>1: Q3.1(OUT) SV1.9 X1.17
BMW19_<: S12.3(P) S12.4(P1) SV6.7 X2.19
BMW19_<1: Q4.1(OUT) SV1.7 X1.19
BMW21_SPDBACK: SV6.5 X2.21
BMW21_SPDBACK1: SV1.5 X1.21
BMW22_SPD: C2.1 R14.2 SV6.4 X2.22
BMW22_SPD1: SV1.4 X1.22
BMW24_10V: PAD_10V_TEST.1(P) R23.2 SV6.6 X2.20
BMW24_10V1: SV1.6 X1.20
DISABLE_MANUAL: DISABLE_MANUAL_TOP.1(P) IC3.5(EIN) IC21.6(B:I1) R30.1
DISABLE_MANUAL_BOT: DISABLE_MANUAL_BOT.1(P) IC1.13(G) IC6.13(G) R37.1
GND: C3.2 C5.2 D2.A D3.A IC1.8(GND) IC3.3(D6) IC3.4(D7) IC3.8(VSS) IC5.9(GND) IC6.8(GND) IC8.8(GND) IC9.8(GND) IC10.8(GND) IC11.8(VSS) IC12.6(B:I1) IC12.7(P:VSS) IC12.9(C:I1) IC13.4(P:V-) IC14.6(INH) IC14.7(VEE) IC14.8(GND) IC14.9(C) IC15.7(P:GND) IC16.4(P:V-) IC18.4(P:V-) IC20.8(VSS) IC21.7(P:VSS) LED_6V_HIGH.K(C) LED_6V_LOW.K(C) LED_6V_OK.K(C) LED_10V_HIGH.K(C) LED_10V_LOW.K(C) LED_10V_OK.K(C) LED_CC_HIGH.K(C) LED_CC_LOW.K(C) LED_CC_OK.K(C) PAD_GND.1(P) Q1.2(GND) Q2.2(GND) Q3.2(GND) Q4.2(GND) Q5.S Q6.S Q7.S Q8.E Q9.2(S) Q10.2(S) Q12.2(S) Q13.2(S) R5.2 R6.2 R7.2 R11.1 R12.1 R13.2 R14.1 R17.1 R24.1 R26.1 R31.2 R32.2 R33.2 R34.2 R35.2 R36.2 R40.1 R41.2 R45.1 R50.1 R57.1 R62.1 R63.1 R64.2 R65.2 R69.2 R77.2 R78.2 R79.2 R85.2 R88.2 RVAR_DREHZAHL.1A RVAR_TACHO.1A S1.3(P) S1.4(P1) S2.3(P) S2.4(P1) S3.3(P) S3.4(P1) SV1.3 SV1.8 SV2.13 SV3.12 SV5.13 SV6.3 SV6.8 SV8.12 X1.13 X1.18 X1.23 X2.13 X2.18 X2.23 X3.12 X4.12
N$2: R2.1 S2.1(S) S2.2(S1)
N$3: R1.1 S1.1(S) S1.2(S1)
N$4: LED_>.K(C) R65.1
N$5: LED_<>.K(C) R77.1
N$6: LED_<.K(C) R78.1
N$7: IC1.15(QA) IC5.1(I1)
N$8: IC1.1(QB) IC5.2(I2)
N$9: IC1.2(QC) IC5.3(I3)
N$10: IC11.5(INH) IC20.5(INH) IC21.4(B:O) R13.1 R64.1
N$11: IC14.12(X0) JP2.3 SPD_BOT.1(P)
N$12: IC21.1(A:I0) R6.1 RPM_TOP.1(P)
N$13: IC3.9(Q0) Q10.1(G)
N$14: IC8.15(INH)
N$15: IC3.6(Q2) Q13.1(G)
N$16: IC1.3(QD) Q7.G
N$17: IC1.4(QE) Q5.G
N$18: IC1.9(QH*) IC6.14(SER)
N$19: IC1.14(SER)
N$21: IC1.12(RCK) IC6.12(RCK)
N$22: S5.1(S) S5.2(S1) S6.1(S) S6.2(S1) S7.1(S) S7.2(S1) S8.1(S) S8.2(S1) S9.1(S) S9.2(S1)
N$23: IC8.9(QH) IC9.10(SER)
N$24: Q6.D R15.1
N$26: JP3.2
N$27: IC1.6(QG) IC5.4(I4)
N$28: IC5.5(I5) IC6.15(QA)
N$29: IC5.6(I6) IC6.1(QB)
N$30: IC5.7(I7) IC6.2(QC)
N$31: IC5.8(I8) IC6.3(QD)
N$32: IC6.4(QE) Q1.3(IN)
N$33: IC6.5(QF) Q2.3(IN)
N$34: IC6.6(QG) Q3.3(IN)
N$35: IC6.7(QH) Q4.3(IN)
N$36: IC8.2(CLK)
N$37: IC8.1(SH/!LD)
N$38: C1.2 IC11.7(CX)
N$39: C1.1 IC11.6(CX)
N$40: IC11.11(R1) R11.2
N$41: IC11.12(R2) R12.2
N$42: C2.2 IC21.10(C:O)
N$43: IC1.5(QF) Q6.G
N$44: LED_G1.A R70.1
N$45: IC11.9(VCOIN) RVAR_TACHO.1S
N$46: IC21.8(C:I0) R5.1 SPD_TOP.1(P)
N$47: LED_WRN.A R87.1
N$48: 2.5VTOAD2.1(P) CC_VOLTAGE_TOP.1(P) D2.C IC18.3(A:+IN) IC18.6(B:-IN) LED_CC.K(C) R17.2
N$49: IC16.5(B:+IN) R16.1 R50.2
N$50: 2.5VTOAD1.1(P) 6V_VOLTAGE_TOP.1(P) IC16.3(A:+IN) IC16.6(B:-IN) R25.1 R26.2
N$51: IC14.14(X) JP2.1
N$52: IC9.9(QH) IC10.10(SER)
N$53: IC3.11(D1) R31.1 S14.C2
N$54: IC3.12(D2) R32.1 S14.C3
N$55: IC3.13(D3) R33.1 S14.C4
N$56: IC3.1(D4) R34.1 S14.C5
N$57: IC3.2(D5) R35.1 S14.C6
N$58: IC3.10(D0) R36.1
N$59: IC14.10(B) IC14.11(A) JP1.1 R41.1
N$60: IC14.15(Y) JP3.3
N$61: Q9.3(D) R43.1
N$62: IC14.13(X1) JP1.3 RPM_BOT.1(P)
N$63: IC12.8(C:I0) R39.1 R40.2
N$64: LED_ABS.K(C) R85.1
N$65: LED_HIB.K(C) R88.1
N$66: LED_DREHZAHL.K(C) R43.2
N$67: IC13.5(B:+IN) R44.1 R45.2
N$68: JP1.2
N$69: JP2.2
N$70: IC13.2(A:-IN) R44.2 R46.1
N$71: 2.5VTOAD.1(P) 10V_VOLTAGE_TOP.1(P) IC13.3(A:+IN) IC13.6(B:-IN) R23.1 R24.2
N$72: IC16.2(A:-IN) R16.2 R51.1
N$73: IC13.1(A:OUT) IC15.1(A:I0) R48.2
N$74: IC13.7(B:OUT) IC15.2(A:I1) R47.2
N$75: LED_10V_LOW.A R47.1
N$76: LED_10V_HIGH.A R48.1
N$77: LED_10V_OK.A R49.1
N$78: 10V_OK_TOP.1(P) IC15.3(A:O) R49.2
N$79: IC11.4(VCOOUT) IC21.9(C:I1)
N$80: IC15.4(B:I0) IC16.1(A:OUT) R53.2
N$81: IC15.5(B:I1) IC16.7(B:OUT) R52.2
N$82: LED_6V_LOW.A R52.1
N$83: LED_6V_HIGH.A R53.1
N$84: LED_6V_OK.A R54.1
N$85: 6V_OK_TOP.1(P) IC15.6(B:O) R54.2
N$86: LED_CC.A R55.2
N$87: IC18.5(B:+IN) R56.1 R57.2
N$88: IC18.2(A:-IN) R56.2 R58.1
N$89: C4.2 IC20.7(CX)
N$90: IC15.9(C:I0) IC18.1(A:OUT) R60.2
N$91: IC15.10(C:I1) IC18.7(B:OUT) R59.2
N$92: LED_CC_LOW.A R59.1
N$93: LED_CC_HIGH.A R60.1
N$94: LED_CC_OK.A R61.1
N$95: CC_VOLTAGE_OK_TOP.1(P) IC15.8(C:O) R61.2
N$96: C4.1 IC20.6(CX)
N$97: IC20.11(R1) R62.2
N$98: IC20.12(R2) R63.2
N$99: IC20.4(VCOOUT) IC21.2(A:I1)
N$100: LED_SWP.K(C) R79.1
N$100_6V: PAD_6V_TEST.1(P) R25.2 SV6.2 X2.24
N$100_6V1: SV1.2 X1.24
N$101: LED_START.K(C) R7.1
N$102: IC20.9(VCOIN) RVAR_DREHZAHL.1S
N$103: Q5.D R76.1
N$104: IC21.3(A:O) R67.1
N$105: Q8.B R67.2
N$106: LED_G2.A R71.1
N$107: D3.C R68.1 R69.1
N$108: LED_G3.A R72.1
N$109: LED_G4.A R73.1
N$110: LED_G5.A R74.1
N$111: LED_N.A R75.1
N$112: IC10.9(QH)
N$115: LED_CHK.A R80.1
N$116: LED_OIL.A R81.1
N$117: LED_TMP.A R82.1
N$118: LED_ALT.A R83.1
N$119: LED_RES.A R84.1
N$120: LED_SPD.A R42.1
N$121: LED_BT.A R86.1
N$128: SV1.1 X1.25
N$130: SV6.1 X2.25
N$131: IC3.7(Q1) Q12.1(G)
RPM_4070N: IC12.10(C:O) IC14.1(Y1)
SPD_4070N: IC12.4(B:O) IC14.2(Y0) JP3.1
SPI_CLK: IC1.11(SCK) IC6.11(SCK)
WAGO1_BAT: SV8.1 X3.1
WAGO1_BAT1: IC7.4(I4) SV3.1 X4.1
WAGO2_CC: R55.1 SV8.2 X3.2
WAGO2_CC1: SV3.2 X4.2
WAGO3_G1: LED_G1.K(C) SV8.3 X3.3
WAGO3_G1.: R18.1 SV3.3 X4.3
WAGO4_G2: LED_G2.K(C) SV8.4 X3.4
WAGO4_G2.: R3.1 SV3.4 X4.4
WAGO5_G3: LED_G3.K(C) SV8.5 X3.5
WAGO5_G3.: R19.1 SV3.5 X4.5
WAGO6_G4: LED_G4.K(C) SV8.6 X3.6
WAGO6_G4.: R20.1 SV3.6 X4.6
WAGO7_G5: LED_G5.K(C) SV8.7 X3.7
WAGO7_G5.: R21.1 SV3.7 X4.7
WAGO8_N: LED_N.K(C) SV8.8 X3.8
WAGO8_N1: R22.1 SV3.8 X4.8
WAGO9_>: LED_>.A SV8.9 X3.9
WAGO9_>1: IC7.1(I1) SV3.9 X4.9
WAGO10_<>: LED_<>.A SV8.10 X3.10
WAGO10_<>1: IC7.2(I2) SV3.10 X4.10
WAGO11_<: LED_<.A SV8.11 X3.11
WAGO11_<1: IC7.3(I3) SV3.11 X4.11
WAGO13_SWP: LED_SWP.A SV8.13 X3.13
WAGO13_SWP1: IC7.5(I5) SV3.13 X4.13
WAGO14_CHK: LED_CHK.K(C) SV7.12 X3.14
WAGO14_CHK1: R89.1 SV4.12 X4.14
WAGO15_OIL: LED_OIL.K(C) SV7.11 X3.15
WAGO15_OIL1: R90.1 SV4.11 X4.15
WAGO16_TMP: LED_TMP.K(C) SV7.10 X3.16
WAGO16_TMP1: R91.1 SV4.10 X4.16
WAGO17_ALT: D1.2(-) SV7.9 X3.17
WAGO17_ALT1: D4.2(-) SV4.9 X4.17
WAGO18_RES: LED_RES.K(C) SV7.8 X3.18
WAGO18_RES1: R93.1 SV4.8 X4.18
WAGO19_ABS: LED_ABS.A SV7.7 X3.19
WAGO19_ABS1: IC7.7(I7) SV4.7 X4.19
WAGO20_BT: LED_BT.K(C) SV7.6 X3.20
WAGO20_BT1: R95.1 SV4.6 X4.20
WAGO21_WRN: LED_WRN.K(C) SV7.5 X3.21
WAGO21_WRN1: R94.1 SV4.5 X4.21
WAGO22_HIB: LED_HIB.A SV7.4 X3.22
WAGO22_HIB1: IC7.8(I8) SV4.4 X4.22
WAGO23_SPD: LED_SPD.K(C) PAD_2_SPEED_FREQUENZZäHLER1.1(P) R4.2 SV7.3 X3.23
WAGO23_SPD1: IC12.5(B:I0) R38.1 SV4.3 X4.23
WAGO24_RPM: PAD_2_RPM_FREQUENZZäHLER2.1(P) Q9.1(G) SV7.2 X3.24
WAGO24_RPM1: R39.2 SV4.2 X4.24
WAGO25_START: SV7.1 X3.25
WAGO25_START1: SV4.1 X4.25
Unconnected: 6V_OK_BOT.1(P) 6V_VOLTAGE_BOT.1(P) 10V_OK_BOT.1(P) 10V_VOLTAGE_BOT.1(P) CC_VOLTAGE_BOT.1(P) CC_VOLTAGE_OK_BOT.1(P) IC1.7(QH) IC3.14(GS) IC3.15(EOUT) IC5.10(CD+) IC6.9(QH*) IC7.10(CD+) IC7.11(O8) IC7.12(O7) IC7.13(O6) IC7.14(O5) IC7.15(O4) IC7.16(O3) IC7.17(O2) IC7.18(O1) IC8.3(E) IC8.4(F) IC8.5(G) IC8.6(H) IC8.7(!QH) IC8.10(SER) IC8.11(A) IC8.12(B) IC8.13(C) IC8.14(D) IC9.1(SH/!LD) IC9.2(CLK) IC9.3(E) IC9.4(F) IC9.5(G) IC9.6(H) IC9.7(!QH) IC9.11(A) IC9.12(B) IC9.13(C) IC9.14(D) IC9.15(INH) IC10.1(SH/!LD) IC10.2(CLK) IC10.3(E) IC10.4(F) IC10.5(G) IC10.6(H) IC10.7(!QH) IC10.11(A) IC10.12(B) IC10.13(C) IC10.14(D) IC10.15(INH) IC11.1(PP) IC11.2(PC1) IC11.3(CIN) IC11.10(DEMO) IC11.13(PC2) IC11.14(SIGIN) IC11.15(ZEN) IC12.1(A:I0) IC12.2(A:I1) IC12.3(A:O) IC12.11(D:O) IC12.12(D:I0) IC12.13(D:I1) IC14.3(Z1) IC14.4(Z) IC14.5(Z0) IC15.11(D:O) IC15.12(D:I0) IC15.13(D:I1) IC20.1(PP) IC20.2(PC1) IC20.3(CIN) IC20.10(DEMO) IC20.13(PC2) IC20.14(SIGIN) IC20.15(ZEN) IC21.11(D:O) IC21.12(D:I0) IC21.13(D:I1) JP4.1 JP4.2 JP5.1 JP5.2 PAD1.1(P) R15.2 RVAR_DREHZAHL.S1 RVAR_DREHZAHL.S2 RVAR_TACHO.S1 RVAR_TACHO.S2 S4.2(S1) S14.A S14.A1 S14.A2 S14.A3 S14.A4 S14.A5 S14.A6 S14.C1 X5.1 X5.2 X5.3 X5.4 X5.5 X5.6 X5.7 X5.8 X5.9

## Buses
BMW[1..24]
WAGO[1..24]

## Notes on the sheet
- 2 Strom 
  1. GND
  2. 5V (optional)
- TP zur LCD Spannungsanzeige
- Spannung an Reserve | 1 optional Ausgang Stromquelle zu AD Wandler
- Rh=Uhist*2*R/(5V-Uhist)
  Uhist=0.8V
- thermistor:tank voll
- R=10k
- thermistor:tank leer
- voltage too low | voltage too high | U=210Ohm*12mA=2.52V
- voltage good
- Stromversorgung (12V + GND)
- Startknopf +12V
- voltage good
- DauerPlus
  Konstant-Strom für LEDs
  Gang 1
  Gang 2
  Gang 3
  Gang 4
  Gang 5
  Neutrallampe
  Blinker rechts
  Blinker zusammen
  Blinker links
  Masse
- DauerPlus Batterie 12V (rot weiss)
  Ganganzeige Signal C (gelb weiss)
  Ganganzeige Signal B (gelb schwarz)
  Ganganzeige Signal A (gelb dunkelblau)
  12V/350mA zum Starknopf (schwarz grün)
  Zündungsplus 12V (grün schwarz)
  Reservelampe (weiss)
  ABS Leuchte (blau)
  Ladekontrollleuchte (schaltet auf Masse) (violett schwarz)
  Temperaturleuchte (schaltet auf Masse) (braun schwarz)
  Öldruckleuchte (schaltet auf Masse) (braun grün)
  Chokelampe (schaltet auf Masse) (violett weiss)
- Zündugsplus
  Choke
  Öldrucklampe
  Temperaturlampe
  Ladekontrolllampe
  Tankgeber (100hm)
  ABS-Lampe
  Lampentest
  Warnlampe
  Fernlichtlampe
  Geschwindigkeitssignal
  neu RPM
- Masse (braun)
  Lampentest (schaltet auf Masse)(weiss blau)
  Fernlichtlampe (12V) (weiss)
  Drehzahl Zündspule (schwarz blau)
  Blinker rechts (blau scharz)
  Masse (braun)
  Blinker links (blau rot)
  nicht angeschlossen
  Tachosiganl zum Blinrelais (balu grün)
  Tachogeber (gelb)
  Masse Tachobeger (braun)
  Tachobeleuchtung (12V Zündungsplus) (grau blau)
- Start
- 6V
- inverter | Spannungsteiler 6V auf 2.5V
- 2.5V an AD Wandler=6V auf BEP
- 10V
- TP zur LCD Spannungsanzeige
- 10V
- R=10k | R=10k
- Rh=Uhist*2*R/(5V-Uhist)
  Uhist=6V+-0.3V/2.4=0.25V
- voltage too low | voltage too high
- Dezimal to Binär Decoder | voltage good
- 2 (optionale) ausgänge AD Wandler
- Spannungsteiler 10V auf 2.5V
- 2.5V an AD Wandler=10V auf BEP
- Set to 0 to disable manual gear shift(all 4028 outputs=0) and enable arduino steering
- Rh=Uhist*2*R/(5V-Uhist)
  Uhist=10V+-0.3V/4=0.15V
- 1:4 Teiler
- R=10k
- voltage too low | voltage too high
- 10V voltage good
- otionaler Ausgang Reserve zu AD Wandler
- 15Bit werden gebraucht von 16Bit
- SPI_MOSI | data
- Schliesser:tank voll (default)
- SPI_Clock | clock
- Schliesser:tank leer
- Thermistor:tank voll
- SPI_SELoutputs | latch | Thermistor:tank leer
- OE_
  set to 5V:high imp
- DauerPlus
  Konstant-Strom für LEDs
  Gang 1
  Gang 2
  Gang 3
  Gang 4
  Gang 5
  Neutrallampe
  Blinker rechts
  Blinker zusammen
  Blinker links
  Masse
- SPI_Clock
- 15:set to GND for operation
- 1:Latch | SPI_SELoutputs
- DauerPlus Batterie 12V (rot weiss)
  Ganganzeige Signal C (gelb weiss)
  Ganganzeige Signal B (gelb schwarz)
  Ganganzeige Signal A (gelb dunkelblau)
  12V/350mA zum Starknopf (schwarz grün)
  Zündungsplus 12V (grün schwarz)
  Reservelampe (weiss)
  ABS Leuchte (blau)
  Ladekontrollleuchte (schaltet auf Masse) (violett schwarz)
  Temperaturleuchte (schaltet auf Masse) (braun schwarz)
  Öldruckleuchte (schaltet auf Masse) (braun grün)
  Chokelampe (schaltet auf Masse) (violett weiss)
- 6 eingänge total
- Zündugsplus
  Choke
  Öldrucklampe
  Temperaturlampe
  Ladekontrolllampe
  Tankgeber (100hm)
  ABS-Lampe
  Lampentest
  Warnlampe
  Fernlichtlampe
  Geschwindigkeitssignal
  neu RPM
- Masse (braun)
  Lampentest (schaltet auf Masse)(weiss blau)
  Fernlichtlampe (12V) (weiss)
  Drehzahl Zündspule (schwarz blau)
  Blinker rechts (blau scharz)
  Masse (braun)
  Blinker links (blau rot)
  nicht angeschlossen
  Tachosiganl zum Blinrelais (balu grün)
  Tachogeber (gelb)
  Masse Tachobeger (braun)
  Tachobeleuchtung (12V Zündungsplus) (grau blau)
- 9:data
- SPI_MISO
- 3 ausgänge multiplexer
  data-->MISO 
  clock and strobe could be shared with input mux
- 5 Ausgänge total
  +4 optional (-->AD Wandler)
- speed in | Buffer
- common in
- Analog Umschalter
- nur 2 der 4 Eingänge werden gebraucht
  1. common+ Select oder
  2. RPM + speed in
- speed out
- RPM in
- speed/common out
- Select Speed(0)/RPM(1)
- common out
- RPM out
- 2 ausgänge
  1. speed + RPM oder
  2 nur common out (Select ist bei Input)
- Buffer
- L:X0 (Speed) selected on common in

## Power pins joined to a net without a drawn wire
GND: IC7.9(GND)

## Library data of the parts
2.5VTOAD 2.5VTOAD1 2.5VTOAD2 6V_OK_BOT 6V_OK_TOP 6V_VOLTAGE_BOT 6V_VOLTAGE_TOP 10V_OK_BOT 10V_OK_TOP 10V_VOLTAGE_BOT 10V_VOLTAGE_TOP CC_VOLTAGE_BOT CC_VOLTAGE_OK_BOT CC_VOLTAGE_OK_TOP CC_VOLTAGE_TOP DISABLE_MANUAL_BOT DISABLE_MANUAL_TOP PAD1 PAD_2_RPM_FREQUENZZäHLER2 PAD_2_SPEED_FREQUENZZäHLER1 PAD_6V_TEST PAD_10V_TEST PAD_12V_IN PAD_GND PAD_RESERVE_SPANNUNG RPM_BOT RPM_TOP SPD_BOT SPD_TOP = wirepad:1,6/0,9: THROUGH-HOLE PAD
C1-C5 = rcl:C-EU: CAPACITOR, European symbol
D1 D4 = Diode-do214ac:DIODE-GEN-PURPOSE-1KV-1A(DO-214AC): 304010013; MPN: 1N4007
D2 D3 = diode:ZENER-DIODE: Z-Diode
IC1 IC6 = 74xx-eu:74*595: 8-bit SHIFT REGISTER, output latch
IC3 = 45xx:4532: 8-bit PRIORITY ENCODER
IC5 IC7 = uln-udn:ULN2803A: DRIVER ARRAY
IC8-IC10 = 74xx-eu:74*165: 8-bit parallel load SHIFT REGISTER
IC11 IC20 = 40xx:4046: Micropower PLL
IC12 IC21 = 40xx:4070: Quad 2-input XOR
IC13 IC16 IC18 = linear:LM358: OP AMP also LM158; LM258; LM2904 Source: http://cache.national.com/ds/LM/LM158.pdf
IC14 = 40xx:4053: Triple 2-channel ANALOG MULTIPLEXER
IC15 = 74xx-eu:74*132: Quad 2-input NAND schmitt trigger
JP1-JP3 = jumper:JP2E: JUMPER
JP4 JP5 = jumper:JP1E: JUMPER
LED_6V_HIGH LED_6V_LOW LED_6V_OK LED_10V_HIGH LED_10V_LOW LED_10V_OK LED_< LED_<> LED_> LED_ABS LED_ALT LED_BT LED_CC LED_CC_HIGH LED_CC_LOW LED_CC_OK LED_CHK LED_DREHZAHL LED_G1-LED_G5 LED_HIB LED_N LED_OIL LED_RES LED_SPD LED_START LED_SWP LED_TMP LED_WRN = led:LED: LED OSRAM: - CHIPLED LG R971, LG N971, LY N971, LG Q971, LY Q971, LO R971, LY R971 LH N974, LH R974 LS Q976, LO Q976, LY Q976 LO Q996 - Hyper CHIPLED LW Q18S LB Q993, LB Q99A, LB R99A - SideLED LS A670, LO A670, LY A670, LG A670, LP A670 LB A673, LV A673, LT A673, LW A673 LH A674 LY A675 LS A676, LA A676, LO A676, LY A676, LW A676 LS A679, LY A679, LG A679 - Hyper Micro SIDELED® LS Y876, LA Y876, LO Y876, LY Y876 LT Y87S - SmartLED LW L88C, LW L88S LB L89C, LB L89S, LG L890 LS L89K, LO L89K, LY L89K LS L896, LA L896, LO L896, LY L896 - TOPLED LS T670, LO T670, LY T670, LG T670, LP T670 LSG T670, LSP T670, LSY T670, LOP T670, LYG T670 LG T671, LOG T671, LSG T671 LB T673, LV T673, LT T673, LW T673 LH T674 LS T676, LA T676, LO T676, LY T676, LB T676, LH T676, LSB T676, LW T676 LB T67C, LV T67C, LT T67C, LS T67K, LO T67K, LY T67K, LW E67C LS E67B, LA E67B, LO E67B, LY E67B, LB E67C, LV E67C, LT E67C LW T67C LS T679, LY T679, LG T679 LS T770, LO T770, LY T770, LG T770, LP T770 LB T773, LV T773, LT T773, LW T773 LH T774 LS E675, LA E675, LY E675, LS T675 LS T776, LA T776, LO T776, LY T776, LB T776 LHGB T686 LT T68C, LB T68C - Hyper Mini TOPLED® LB M676 - Mini TOPLED Santana® LG M470 LS M47K, LO M47K, LY M47K Source: http://www.osram.convergy.de LUXEON: - LUMILED® LXK2-PW12-R00, LXK2-PW12-S00, LXK2-PW14-U00, LXK2-PW14-V00 LXK2-PM12-R00, LXK2-PM12-S00, LXK2-PM14-U00 LXK2-PE12-Q00, LXK2-PE12-R00, LXK2-PE12-S00, LXK2-PE14-T00, LXK2-PE14-U00 LXK2-PB12-K00, LXK2-PB12-L00, LXK2-PB12-M00, LXK2-PB14-N00, LXK2-PB14-P00, LXK2-PB14-Q00 LXK2-PR12-L00, LXK2-PR12-M00, LXK2-PR14-Q00, LXK2-PR14-R00 LXK2-PD12-Q00, LXK2-PD12-R00, LXK2-PD12-S00 LXK2-PH12-R00, LXK2-PH12-S00 LXK2-PL12-P00, LXK2-PL12-Q00, LXK2-PL12-R00 Source: www.luxeon.com KINGBRIGHT: KA-3528ASYC Source: www.kingbright.com
Q1-Q4 = BSP452:BSP452
Q5-Q7 = transistor-power:IRF540: HEXFET Power MOSFET
Q8 = transistor-npn:BC548*: NPN Transistor
Q9 Q10 Q12 Q13 = bss138_10:BSS138: BSS138 N-Channel Logic Level Enhancement Mode Field Effect Transistor Source: http://www.fairchildsemi.com/datasheets/BS/BSS138.pdf; MF: Fairchild; MPN: BSS138; OC_FARNELL: 9845330; OC_NEWARK: 67R2009
R1-R7 R11-R26 R30-R95 = rcl:R-EU_: RESISTOR, European symbol
RVAR_DREHZAHL RVAR_TACHO = piher:PC16SV: POTENTIOMETER vertical single carbon potentiometer with switch, 16 mm; OC_FARNELL: unknown; OC_NEWARK: unknown
S1-S12 = switch-omron:40-XX: OMRON SWITCH; MF: OMRON COMPONENTS USA; MPN: B3F-4000; OC_FARNELL: 176434; OC_NEWARK: 36K3105
S14 = switch:CK102X06: ROTARY SWITCH C&K
SV1 SV4 SV6 SV7 = con-lstb:MA12-1: PIN HEADER; OC_FARNELL: unknown; OC_NEWARK: unknown
SV2 SV3 SV5 SV8 = con-lstb:MA13-1: PIN HEADER; OC_FARNELL: unknown; OC_NEWARK: unknown
U$1-U$4 = Fiducial:FIDUCIAL: For use by pick and place machines to calibrate the vision/machine, 1mm By microbuilder.eu
X1-X4 = con-subd:F25: SUB-D; OC_FARNELL: unknown; OC_NEWARK: unknown
X5 = con-subd:F09: SUB-D; OC_FARNELL: unknown; OC_NEWARK: unknown